# Altium schematic sheet top_power.SchDoc: Electrical Power System - General Block Diagram - Power
size A4; Date: 2016-03-14; Author: Piotr Kuligowski; Revision: 1-0; SheetTotal: 14; Model: EM1; PageSetup: Record=PageOptions|CenterHorizontal=True|CenterVertical=True|PrintScale=0.52|XCorrection=1.00|YCorrection=1.00|PrintKind=1|BorderSize=5000000|LeftOffset=0|BottomOffset=0|Orientation=2|PaperLength=4200|PaperWidth=2970|Scale=100|PaperSource=7|PrintQuality=600|MediaType=1|DitherType=10|PaperKind=A3|PrintScaleMode=1
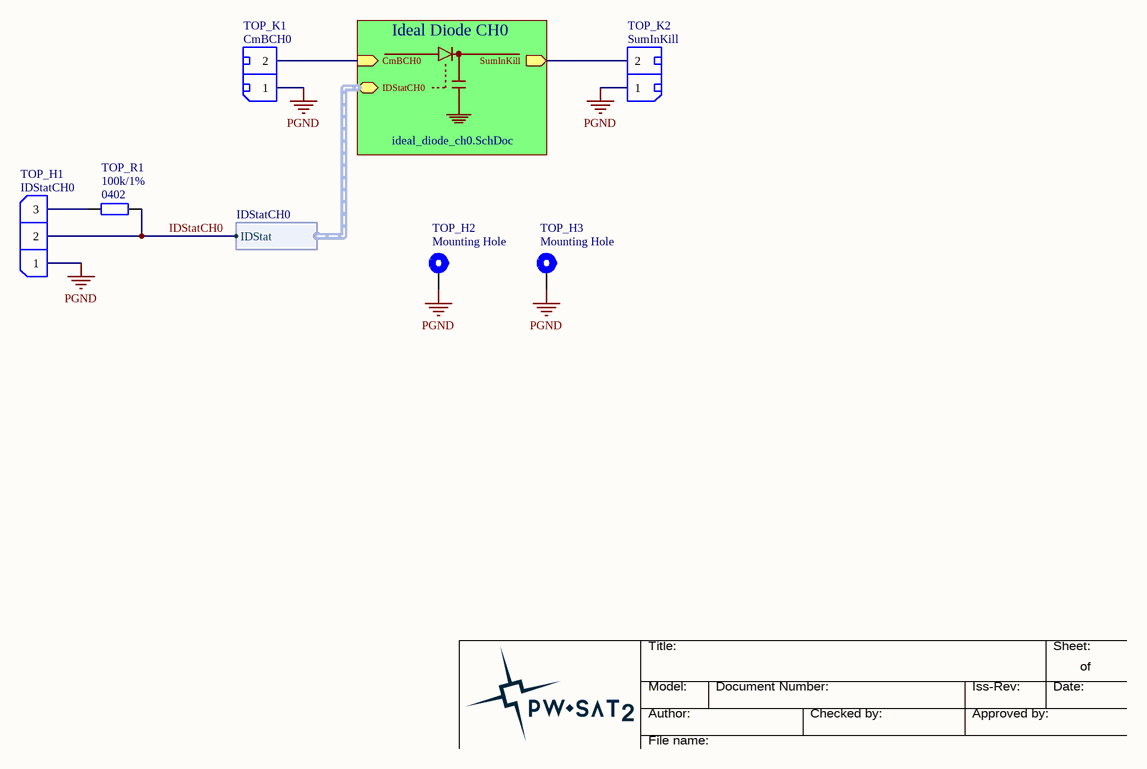
[diagram p0: top_power.SchDoc]

## Parts
TOP_H1  IDStatCH0  [Harwin_Datamate_L-Tek_M80-8770305]
TOP_H2  Mounting Hole  [PC-104_PcbMntHole_M3]
TOP_H3  Mounting Hole  [PC-104_PcbMntHole_M3]
TOP_K1  ProviderPartNumber: CmBCH0  [TerminalBlock_Spring_2.54_2-R]  (hidden comment: TB-2.5-PD-xx)
TOP_K2  ProviderPartNumber: SumInKill  [TerminalBlock_Spring_2.54_2-R]  (hidden comment: TB-2.5-PD-xx)
TOP_R1  Package: 0402  [SMD_Resistor_0402]  (hidden comment: 100k/1%)

## Sub-sheets
Ideal Diode CH0 = ideal_diode_ch0.SchDoc: SumInKill (out), CmBCH0 (in), IDStatCH0 (harness IDStatCH0)

## Harnesses
IDStatCH0: IDStat

## Nets
PGND: TOP_H1.1 TOP_H2.1 TOP_H3.1 TOP_K1.1 TOP_K2.1
IDStatCH0: TOP_H1.2 TOP_R1.2 ; sheet Ideal Diode CH0/IDStatCH0.IDStat
NetTOP_H1_3: TOP_H1.3 TOP_R1.1
NetTOP_K1_2: TOP_K1.2 ; sheet Ideal Diode CH0/CmBCH0
NetTOP_K2_2: TOP_K2.2 ; sheet Ideal Diode CH0/SumInKill

## Notes on the sheet
- Title:
- Sheet:
- of
- Author:
- Model:
- Document Number:
- Checked by:
- Iss-Rev:
- Approved by:
- Date:
- File name:

## Library data of the parts
TOP_H1 = Harwin_Datamate_L-Tek_1x3pin: Harwin DataMate L-Tek, 2mm pitch, 1x3pin.; Value: Harwin DataMate L-Tek 1x3pin
TOP_H2 TOP_H3 = MntHole: PCB Mounting Hole; Value: Mounting Hole
TOP_K1 TOP_K2 = TerminalBlock_Spring_2.54_2-R: Terminal block with spring, 2-pin, 2.54mm pitch, right angle.; Provider: TME.eu; Value: TB-2.5-PD-xx
TOP_R1 = CRCW0402100KFKxxxx: 100k/1% Vishay CRCW 0402 Resistor. 63mW, 100ppm, 50V.; Manufacturer: Vishay; Value: 100k/1%